# Altium schematic sheet 03. ZIGBEE.SchDoc
size A3
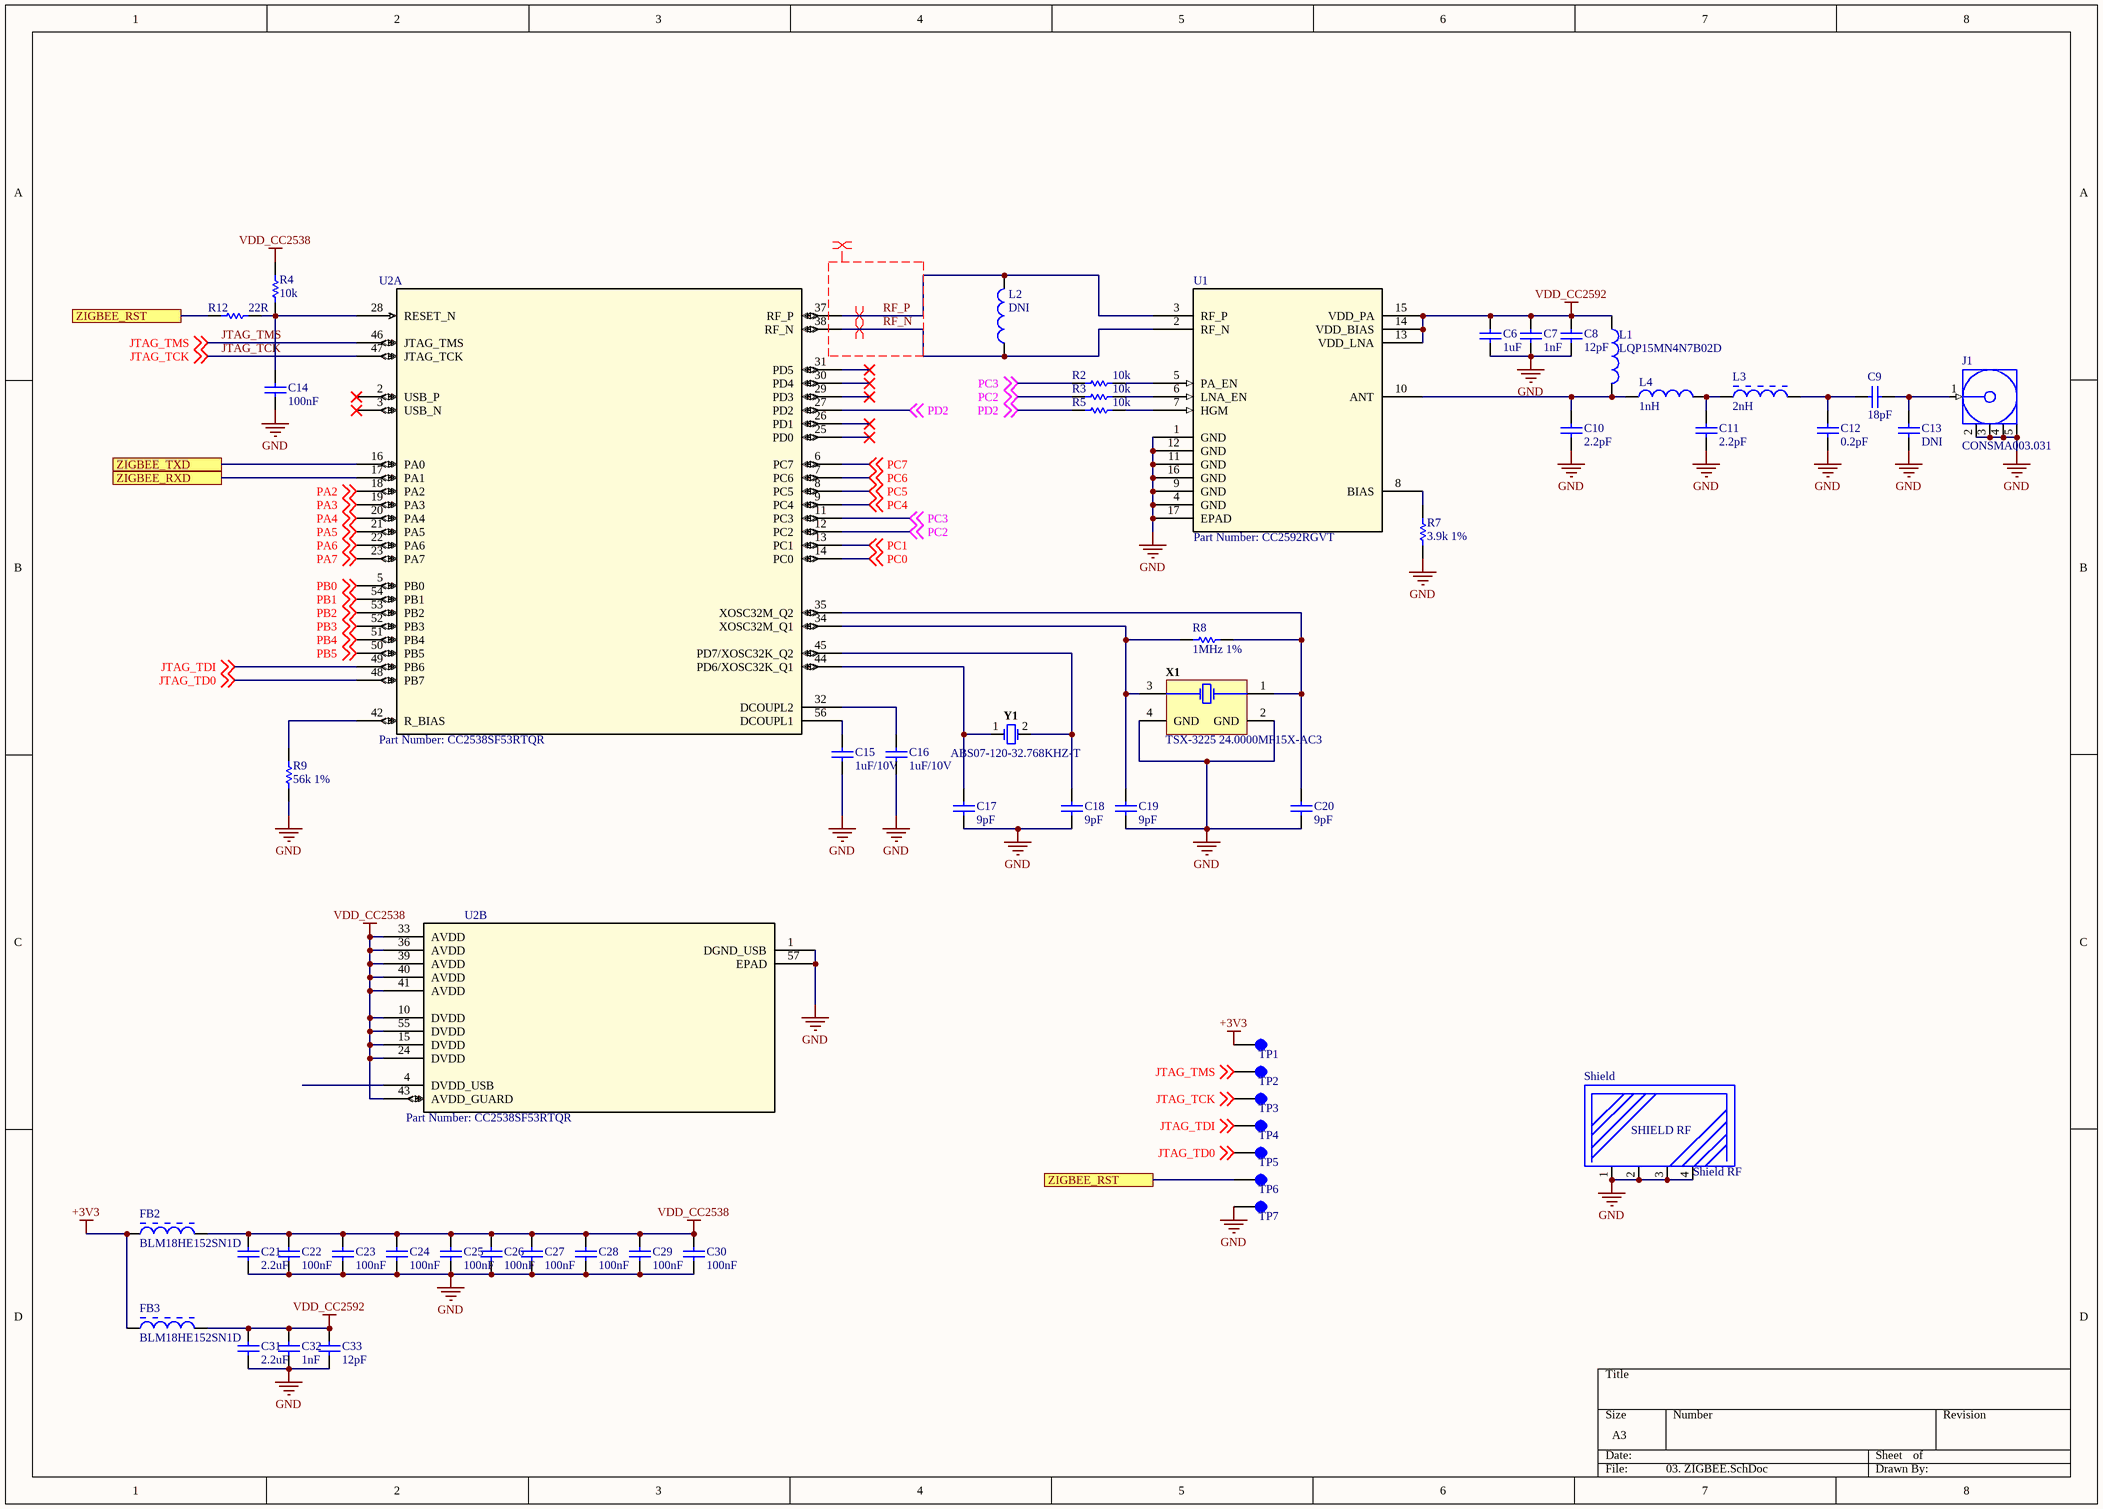
[diagram p0: 03. ZIGBEE.SchDoc]

## Parts
C6  1uF  [CAPC1608X90X20NL10]
C7  1nF  [CAPC1005X55X25NL05T10]
C8  12pF  [CAPC1005X55X25NL05T10]
C9  18pF  [CAPC1005X55X25NL05T10]
C10  2.2pF  [CAPC1005X55X25NL05T10]
C11  2.2pF  [CAPC1005X55X25NL05T10]
C12  0.2pF  [CAPC1005X55X25NL05T10]
C13  DNI  [CAPC1005X55X25NL05T10]
C14  100nF  [CAPC1005X56X25NL10T15]
C15  1uF/10V  [CAPC1005X55X25NL05T10]
C16  1uF/10V  [CAPC1005X55X25NL05T10]
C17  9pF  [CAPC1005X55X25NL05T10]
C18  9pF  [CAPC1005X55X25NL05T10]
C19  9pF  [CAPC1005X55X25NL05T10]
C20  9pF  [CAPC1005X55X25NL05T10]
C21  2.2uF  [CAPC1608X90X35NL10T15]
C22  100nF  [CAPC1005X56X25NL10T15]
C23  100nF  [CAPC1005X56X25NL10T15]
C24  100nF  [CAPC1005X56X25NL10T15]
C25  100nF  [CAPC1005X56X25NL10T15]
C26  100nF  [CAPC1005X56X25NL10T15]
C27  100nF  [CAPC1005X56X25NL10T15]
C28  100nF  [CAPC1005X56X25NL10T15]
C29  100nF  [CAPC1005X56X25NL10T15]
C30  100nF  [CAPC1005X56X25NL10T15]
C31  2.2uF  [CAPC1608X90X35NL10T15]
C32  1nF  [CAPC1005X55X25NL05T10]
C33  12pF  [CAPC1005X55X25NL05T10]
FB2  BLM18HE152SN1D  [MURA-BLM18-RF-H4-CHIP-2_V]
FB3  BLM18HE152SN1D  [MURA-BLM18-RF-H4-CHIP-2_V]
J1  CONSMA003.031  [CON-SMA-EDGE031]
L1  LQP15MN4N7B02D  [INDC1005X45X25LL10T10]
L2  DNI  [INDC1005X45X25NL10T10]
L3  2nH  [MURA-IND0402_V]
L4  1nH  [INDC1005X45X25NL10T10]
R2  10k  [RESC1005X40X25NL05T05]
R3  10k  [RESC1005X40X25NL05T05]
R4  10k  [RESC1005X40X25NL05T05]
R5  10k  [RESC1005X40X25NL05T05]
R7  3.9k 1%  [RESC1005X40X25NL05T05]
R8  1MHz 1%  [RESC1005X40X25NL05T05]
R9  56k 1%  [RESC1005X40X25NL05T05]
R12  22R  [RESC1005X40X25LL05T05]
Shield  Shield RF  [NSTRFShield]
TP1  Test Point  [TP]  (value not drawn)
TP2  Test Point  [TP]  (value not drawn)
TP3  Test Point  [TP]  (value not drawn)
TP4  Test Point  [TP]  (value not drawn)
TP5  Test Point  [TP]  (value not drawn)
TP6  Test Point  [TP]  (value not drawn)
TP7  Test Point  [TP]  (value not drawn)
U1  Part Number: CC2592RGVT  [QFN16_2P16X2P16]
U2  Part Number: CC2538SF53RTQR  [QFN56_6P7X6P7]  (parts A,B of 2)
X1  TSX-3225 24.0000MF15X-AC3  [FP-NX3225SA-MFG]
Y1  ABS07-120-32.768KHZ-T  [ABRA-ABS07_A_V]

## Ports
ZIGBEE_RST, ZIGBEE_RXD, ZIGBEE_TXD

## Nets
+3V3: FB2.1 FB3.1 TP1.1
GND: C6.1 C7.1 C8.1 C10.1 C11.1 C12.1 C13.1 C14.1 C15.1 C16.1 C17.1 C18.1 C19.1 C20.1 C21.1 C22.1 C23.1 C24.1 C25.1 C26.1 C27.1 C28.1 C29.1 C30.1 C31.1 C32.1 C33.1 J1.2(GND) J1.3(GND) J1.4(GND) J1.5(GND) R7.1 R9.1 Shield.1 Shield.2 Shield.3 Shield.4 TP7.1 U1.1(GND) U1.4(GND) U1.9(GND) U1.11(GND) U1.12(GND) U1.16(GND) U1.17(EPAD) U2.1(DGND_USB) U2.57(EPAD) X1.2(GND) X1.4(GND)
VDD_CC2538: C21.2 C22.2 C23.2 C24.2 C25.2 C26.2 C27.2 C28.2 C29.2 C30.2 FB2.2 R4.2 U2.10(DVDD) U2.15(DVDD) U2.24(DVDD) U2.33(AVDD) U2.36(AVDD) U2.39(AVDD) U2.40(AVDD) U2.41(AVDD) U2.43(AVDD_GUARD) U2.55(DVDD)
VDD_CC2592: C6.2 C7.2 C8.2 C31.2 C32.2 C33.2 FB3.2 L1.1 U1.13(VDD_LNA) U1.14(VDD_BIAS) U1.15(VDD_PA)
JTAG_TCK: TP3.1 U2.47(JTAG_TCK) ; off-sheet JTAG_TCK
JTAG_TD0: TP5.1 U2.48(PB7) ; off-sheet JTAG_TD0
JTAG_TDI: TP4.1 U2.49(PB6) ; off-sheet JTAG_TDI
JTAG_TMS: TP2.1 U2.46(JTAG_TMS) ; off-sheet JTAG_TMS
PA2: U2.18(PA2) ; off-sheet PA2
PA3: U2.19(PA3) ; off-sheet PA3
PA4: U2.20(PA4) ; off-sheet PA4
PA5: U2.21(PA5) ; off-sheet PA5
PA6: U2.22(PA6) ; off-sheet PA6
PA7: U2.23(PA7) ; off-sheet PA7
PB0: U2.5(PB0) ; off-sheet PB0
PB1: U2.54(PB1) ; off-sheet PB1
PB2: U2.53(PB2) ; off-sheet PB2
PB3: U2.52(PB3) ; off-sheet PB3
PB4: U2.51(PB4) ; off-sheet PB4
PB5: U2.50(PB5) ; off-sheet PB5
PC0: U2.14(PC0) ; off-sheet PC0
PC1: U2.13(PC1) ; off-sheet PC1
PC2: R3.1 U2.12(PC2) ; off-sheet PC2
PC3: R2.1 U2.11(PC3) ; off-sheet PC3
PC4: U2.9(PC4) ; off-sheet PC4
PC5: U2.8(PC5) ; off-sheet PC5
PC6: U2.7(PC6) ; off-sheet PC6
PC7: U2.6(PC7) ; off-sheet PC7
PD2: R5.1 U2.27(PD2) ; off-sheet PD2
RF_N: L2.1 U1.2(RF_N) U2.38(RF_N)
RF_P: L2.2 U1.3(RF_P) U2.37(RF_P)
ZIGBEE_RST: R12.1 TP6.1 ; port ZIGBEE_RST
ZIGBEE_RXD: U2.17(PA1) ; port ZIGBEE_RXD
ZIGBEE_TXD: U2.16(PA0) ; port ZIGBEE_TXD
NetC9_1: C9.1 C12.2 L3.2
NetC9_2: C9.2 C13.2 J1.1(Signal)
NetC10_2: C10.2 L1.2 L4.1 U1.10(ANT)
NetC11_2: C11.2 L3.1 L4.2
NetC14_2: C14.2 R4.1 R12.2 U2.28(RESET_N)
NetC15_2: C15.2 U2.56(DCOUPL1)
NetC16_2: C16.2 U2.32(DCOUPL2)
NetC17_2: C17.2 U2.44(PD6/XOSC32K_Q1) Y1.1
NetC18_2: C18.2 U2.45(PD7/XOSC32K_Q2) Y1.2
NetC19_2: C19.2 R8.1 U2.34(XOSC32M_Q1) X1.3(X2)
NetC20_2: C20.2 R8.2 U2.35(XOSC32M_Q2) X1.1(X1)
NetR2_2: R2.2 U1.5(PA_EN)
NetR3_2: R3.2 U1.6(LNA_EN)
NetR5_2: R5.2 U1.7(HGM)
NetR7_2: R7.2 U1.8(BIAS)
NetR9_2: R9.2 U2.42(R_BIAS)

Not connected (* = marked no-connect by the designer): U2 2(USB_P)* 3(USB_N)* 4(DVDD_USB) 25(PD0)* 26(PD1)* 29(PD3)* 30(PD4)* 31(PD5)*

## Layout directives
differential pair: RF_N, RF_P
net class ZIGBEE_RF; rule Matched Net Lengths [Tolerance = 10mil]: RF_N, RF_P

## Notes on the sheet
- (in symbol Shield RF) SHIELD RF

## Library data of the parts
C6 = CMP-2000-06025-1: Chip Capacitor, 1 uF, +/- 10%, 50 V, -55 to 85 degC, 0603 (1608 Metric), RoHS, Tape and Reel; Manufacturer: TDK; PCN Part Number: MLCCPartNumberChange30/Nov/2012; Other Names: 445-7468-6; Online Catalog: CSeries,GeneralPurpose; Capacitance: 1µF; Product Training Modules: CSeriesGeneralApplicationsSEAT,CCV,andTVCLDesignToolsGuidetoReplacinganElectrolyticCapacitorwithanMLCC; Voltage - Rated: 50V; Design Resources: 20WNon-IsolatedBuckLEDDriverUsingPLLNK460KG; Temperature Coefficient: X5R; Series: C; Datasheet Version: 08/2016; Package Description: 2-Pin Surface Mount Device, Body 1.6 x 0.8 mm; Mounting Technology: SurfaceMount; Features: -; Size / Dimension: 0.063"Lx0.031"W(1.60mmx0.80mm); Lead Spacing: -; Operating Temperature: -55°C~85°C; Tolerance: ±10%; Height - Seated (Max): -; Mounting Type: SurfaceMount,MLCC; Ratings: -; Standard Package: 1; Applications: GeneralPurpose; Datasheet URL: https://product.tdk.com/info/en/catalog/datasheets/mlcc_commercial_general_en.pdf; Category: Capacitors; Lead Style: -; Packaging: Digi-Reel®; RoHS Information: RoHSCertificate-MLCC; Package / Case: 0603(1608Metric); Package Reference: 0603; Manufacturer URL: http://www.tdk.com/; Thickness (Max): 0.035"(0.90mm); Family: CeramicCapacitors
C7 C32 = CMP-2008-04254-1: Part Number: GRM1555C1H102JA01D; Manufacturer: Murata
C8 C33 = CMP-2008-03945-1: Part Number: GRM1555C1H120GA01D; Manufacturer: Murata
C9 C13 = CMP-2008-03748-1: Part Number: GJM1555C1H180GB01D; Manufacturer: Murata
C10 C11 = CMP-2008-03835-1: Part Number: GJM1555C1H2R2BB01D; Manufacturer: Murata
C12 = CMP-2008-03980-1: Part Number: GRM1555C1HR20WA01D; Manufacturer: Murata
C14 C22-C30 = CMP-2008-02743-1: Manufacturer: AVX Interconnect / Elco; Part Number: 04026D104KAT2A
C15 C16 = CMP-2008-04556-1: Part Number: GRM155R61A105KE15D; Manufacturer: Murata
C17-C20 = CMP-2008-03890-1: Part Number: GJM1555C1H9R0CB01D; Manufacturer: Murata
C21 C31 = CMP-2006-02354-1: Manufacturer: Murata; Part Number: GCM188R70J225KE22D
FB2 FB3 = CMP-0686-00368-2: Chip Ferrite Bead for GHz Band High-speed Signal Lines, 1500 Ohm, 500 mA, -55 to 125 degC, 1.6 x 0.8 x 0.95 mm SMD, Tape and Reel; Manufacturer: Murata; Rated Current: 500 mA; Impedance (at 100 MHz): 1500 Ohm +/- 25%; DC Resistance: 0.50 Ohm Max.; Packing: Tape and Reel; DatasheetVersion: 08/2013; ComponentLink1URL: http://www.murata.com/; Mounting Technology: Surface Mount; ComponentLink2URL: http://www.murata.com/products/catalog/pdf/c31e.pdf; ComponentLink3Description: Package Specification; ComponentLink2Description: Datasheet; PackageReference: BLM18_H950-2; ComponentLink1Description: Manufacturer URL; PackageDescription: 2-Pin Chip, Body 1.6 x 0.8 mm; ComponentLink3URL: http://www.murata.com/products/catalog/pdf/c31e.pdf; PartNumber: BLM18HE152SN1D; Operating Temperature Range: -55 to 125 degC
J1 = CMP-0168-00026-1: SMA Female Edge Mount Connector for 0.031" Thick Board; PCB_Layout: Pads complies with manufacturer's recommendation.; PackageReference: CON-SMA-EDGE031; PackageDescription: SMA Female Edge Mount Connector for 0.031" Thick Board, 7.9 mm Body Dia.; DatasheetVersion: rev1.0, Jul-2006; PackageVersion: rev1.0, Jul-2006
L1 = CMP-2000-06592-1: Chip Inductor, 4.7 nH, +/- 0.1 nH, 160 mA, -40 to 85 degC, 0402 (1005 Metric), RoHS, Tape and Reel; Manufacturer: Murata; Maximum DC Resistance: 600mOhm; Type: RFChip; Inductance: 4.7nH; Product Height: 0.45mm; Maximum DC Current: 160mA; Minimum Quality Factor: 13@500MHz; Rad Hard: No; Tolerance: 0.1nH; Product Depth: 0.6mm; Package Description: 2-Pin Surface Mount Device, Body 1 x 0.5 mm; Package Reference: 0402; Datasheet Version: 09/2010; Packaging: Tape&Reel; Manufacturer URL: http://www.murata.com/; Package/Case: 0402; Datasheet URL: http://search.murata.co.jp/Ceramy/image/img/PDF/ENG/L0075S0084LQP15M.pdf; Mounting Technology: SurfaceMount
L2 = CMP-2000-06590-1: Chip Inductor, 1.8 nH, +/- 0.1 nH, 280 mA, -40 to 85 degC, 0402 (1005 Metric), RoHS, Tape and Reel; Manufacturer: Murata; DC Resistance: 0.2O; Tolerance (nH): ±0.1nH; Rated Current-Max: 280mA; Inductance-Nom: 1.8nH; Manufacturer URL: http://www.murata.com/; Mounting Technology: SurfaceMount; Datasheet URL: http://search.murata.co.jp/Ceramy/image/img/PDF/ENG/L0075S0084LQP15M.pdf; Datasheet Version: 09/2010; Package Reference: 0402; Case Size/Dimension: 0402; Package Description: 2-Pin Surface Mount Device, Body 1 x 0.5 mm
L3 = CMP-0499-00001-3: Chip Inductor (Chip Coil) for High Frequency Multilayer, 2 +/- 0.3 nH, 300 mA, 0402 (1005), 180mm Paper Tape; Manufacturer: Murata; PartNumber: LQG15HS2N0S02D; Self Resonance Frequency (min.): 6000 MHz; Inductance Test Frequency: 100 MHz; Inductance: 2.0 nH +/- 0.3 nH; Rated Current (Itemp) (Based on Temperature rise): 300 mA; Max. Of DC Resistance: 0.1 ohm; Q (min.): 8; Operating Temperature Range: -55 to 125 degC; Mounting Technology: Surface Mount; PackageDescription: 2-Pin SMT Inductor, 1 x 0.5 mm Body; ComponentLink2URL: http://search.murata.co.jp/Ceramy/image/img/PDF/ENG/L0075S0083LQG15HS.pdf; ComponentLink1Description: Manufacturer URL; ComponentLink3URL: http://search.murata.co.jp/Ceramy/image/img/PDF/ENG/L0075S0083LQG15HS.pdf; ComponentLink1URL: http://www.murata.com/; ComponentLink2Description: Datasheet; RoHS: Yes; ComponentLink3Description: Package Specification; Q Test Frequency: 100 MHz; PackageReference: IND0402
L4 = CMP-1662-00009-1: Chip Inductor, 1 nH, +/- 0.1 nH, 400 mA, -40 to 85 degC, 0402 (1005 Metric), RoHS, Tape and Reel; PartNumber: LQP15MN1N0B02D; Height: 0.35 mm; Mounting Technology: Surface Mount; Radiation Hardening: No; Max Operating Temperature: 85 degC; Package Quantity: 10000; ComponentLink2Description: Datasheet; ComponentLink2URL: https://www.modelithics.com/models/Vendor/MuRata/LQP15M.pdf; RoHSCompliant: True; ComponentLink1Description: Manufacturer URL; Mount: Surface Mount; Width: 0.5 mm; Min Operating Temperature: -40 degC; Length: 1 mm; ComponentLink1URL: http://www.murata.com/; DatasheetVersion: 09/2010; PackageDescription: 2-Pin Surface Mount Device, Body 1 x 0.5 mm; Case/Package: 0402; Packaging: Tape and Reel
R2-R5 = CMP-2002-08135-1: Manufacturer: Vishay Dale; Part Number: CRCW040210K0FKED
R7 = CMP-2002-08592-1: Manufacturer: Vishay Dale; Part Number: CRCW04023K90FKED
R8 = CMP-2002-08122-1: Part Number: CRCW04020000Z0ED; Manufacturer: Vishay Dale
R9 = CMP-2002-00101-1: Part Number: CRCW040256K0FKED; Manufacturer: Vishay Dale
R12 = CMP-1665-00027-3: Chip Resistor, 22 Ohm, +/- 1%, 0.1 W, -55 to 155 degC, 0402 (1005 Metric), RoHS, Tape and Reel; PartNumber: ERJ-2RKF22R0X; Case\/Package: 0402; Resistance: 22 Ohm; Power Rating: 100 mW; Voltage Rating: 50 V; ComponentLink2Description: Datasheet; Packaging: Tape and Reel; Weight: 2.8E-05oz; Pins: 2; Case Code (Imperial): 0402; Width: 0.5 mm; ComponentLink2URL: http://industrial.panasonic.com/cdbs/www-data/pdf/RDA0000/AOA0000C86.pdf; Height: 0.35 mm; PackageReference: 0402; REACH SVHC: Yes; Min Operating Temperature: -55 degC; Length: 1 mm; DatasheetVersion: 04/2015; RoHSCompliant: true; Package Quantity: 10000; Case Code (Metric): 1005; PackageDescription: 2-Pin Surface Mount Device, Body 1 x 0.5 mm; ComponentLink1URL: http://www.panasonic.com/; Mount: Surface Mount; Mounting Technology: Surface Mount; Tolerance: 1%; Max Operating Temperature: 155 degC; ComponentLink1Description: Manufacturer URL
TP1-TP7 = TP
U1 = CC2592RGVT: No Description Available; Vendor: Texas Instruments; Built_By: EMA_UL_Team; Manufacturer_Part_Number: CC2592RGVT; Copyright: Copyright (C) 2018 Accelerated Designs. All rights reserved; RefDes: RefDes; Type: DEV; Value: Value
U2 = CC2538SF53RTQR: IC RF TxRx + MCU 802.15.4 6LoWPAN, Zigbee® 2.4GHz 56-VFQFN Exposed Pad; Vendor: Texas Instruments; Built_By: EMA_UL_Team; Manufacturer_Part_Number: CC2538SF53RTQR; Copyright: Copyright (C) 2018 Accelerated Designs. All rights reserved; RefDes: RefDes; Type: DEV; Value: Value
X1 = CMP-2000-07333-1: MHz Range Crystal, 24 MHz, -40 to 85 degC, 4-Pin SMD, RoHS, Tape and Reel; Manufacturer: Epson; Brand: EpsonTiming; Frequency Stability: 10PPM; Frequency: 24MHz; ESR: 40Ohms; Load Capacitance: 9pF; Unit Weight: 0.000564oz; Drive Level: 200uW; Datasheet Version: 12/2015; RoHS: True; Operating Temperature Range: -40Cto+85C; Length: 3.2mm; Tolerance: 10PPM; Width: 2.5mm; Mounting Technology: SurfaceMount; Package Description: 4-Pin Surface Mount Device, Body 3.2 x 2.5 mm; Manufacturer URL: https://www.eea.epson.com/; Factory Pack Quantity: 250; Package Reference: TSX-3225; Height: 0.6mm; Mounting Style: SMD/SMT; Termination Style: SMD/SMT; Datasheet URL: https://support.epson.biz/td/api/doc_check.php?dl=brief_FA-238V_en.pdf; Type: Crystal; Series: TSX-3225; Package / Case: 3.2mmx2.5mm; Product Category: Crystals; Packaging: Reel
Y1 = CMP-2000-07587-1: Tuning Fork Crystal, 32.768 KHz, +/- 20 ppm, -40 to 85 degC, 2-Pin SMD, RoHS, Tape and Reel; Manufacturer: Abracon; Case\/Package: SMD/SMT; Series Resistance: 60KOhm; Frequency Tolerance: 20ppm; Load Capacitance: 6pF; ESR (Equivalent Series Resistance): 55KOhm; Max Operating Temperature: 85degC; Width: 0.061inch; Radiation Hardening: No; Lead Free: LeadFree; RoHSCompliant: True; Depth: 1.5mm; Datasheet URL: http://www.abracon.com/Resonators/ABS07-120-32.768kHz-T.pdf; Frequency: 32.768KHz; Termination: SMD/SMT; Manufacturer URL: http://www.abracon.com/; Package Quantity: 3000; Packaging: TapeandReel; Number of Pins: 2; Height: 0.035inch; Package Description: 2-Pin Surface Mount Device, Body 3.2 x 1.5 mm; Package Reference: ABS07; Mount: SurfaceMount; Tolerance: 20ppm; Mounting Technology: SurfaceMount; REACH SVHC: NoSVHC; Datasheet Version: 11/2014; Length: 3.2mm; Min Operating Temperature: -40degC